# EAGLE design C64_AV-Adaptor (EAGLE 9.5.2)
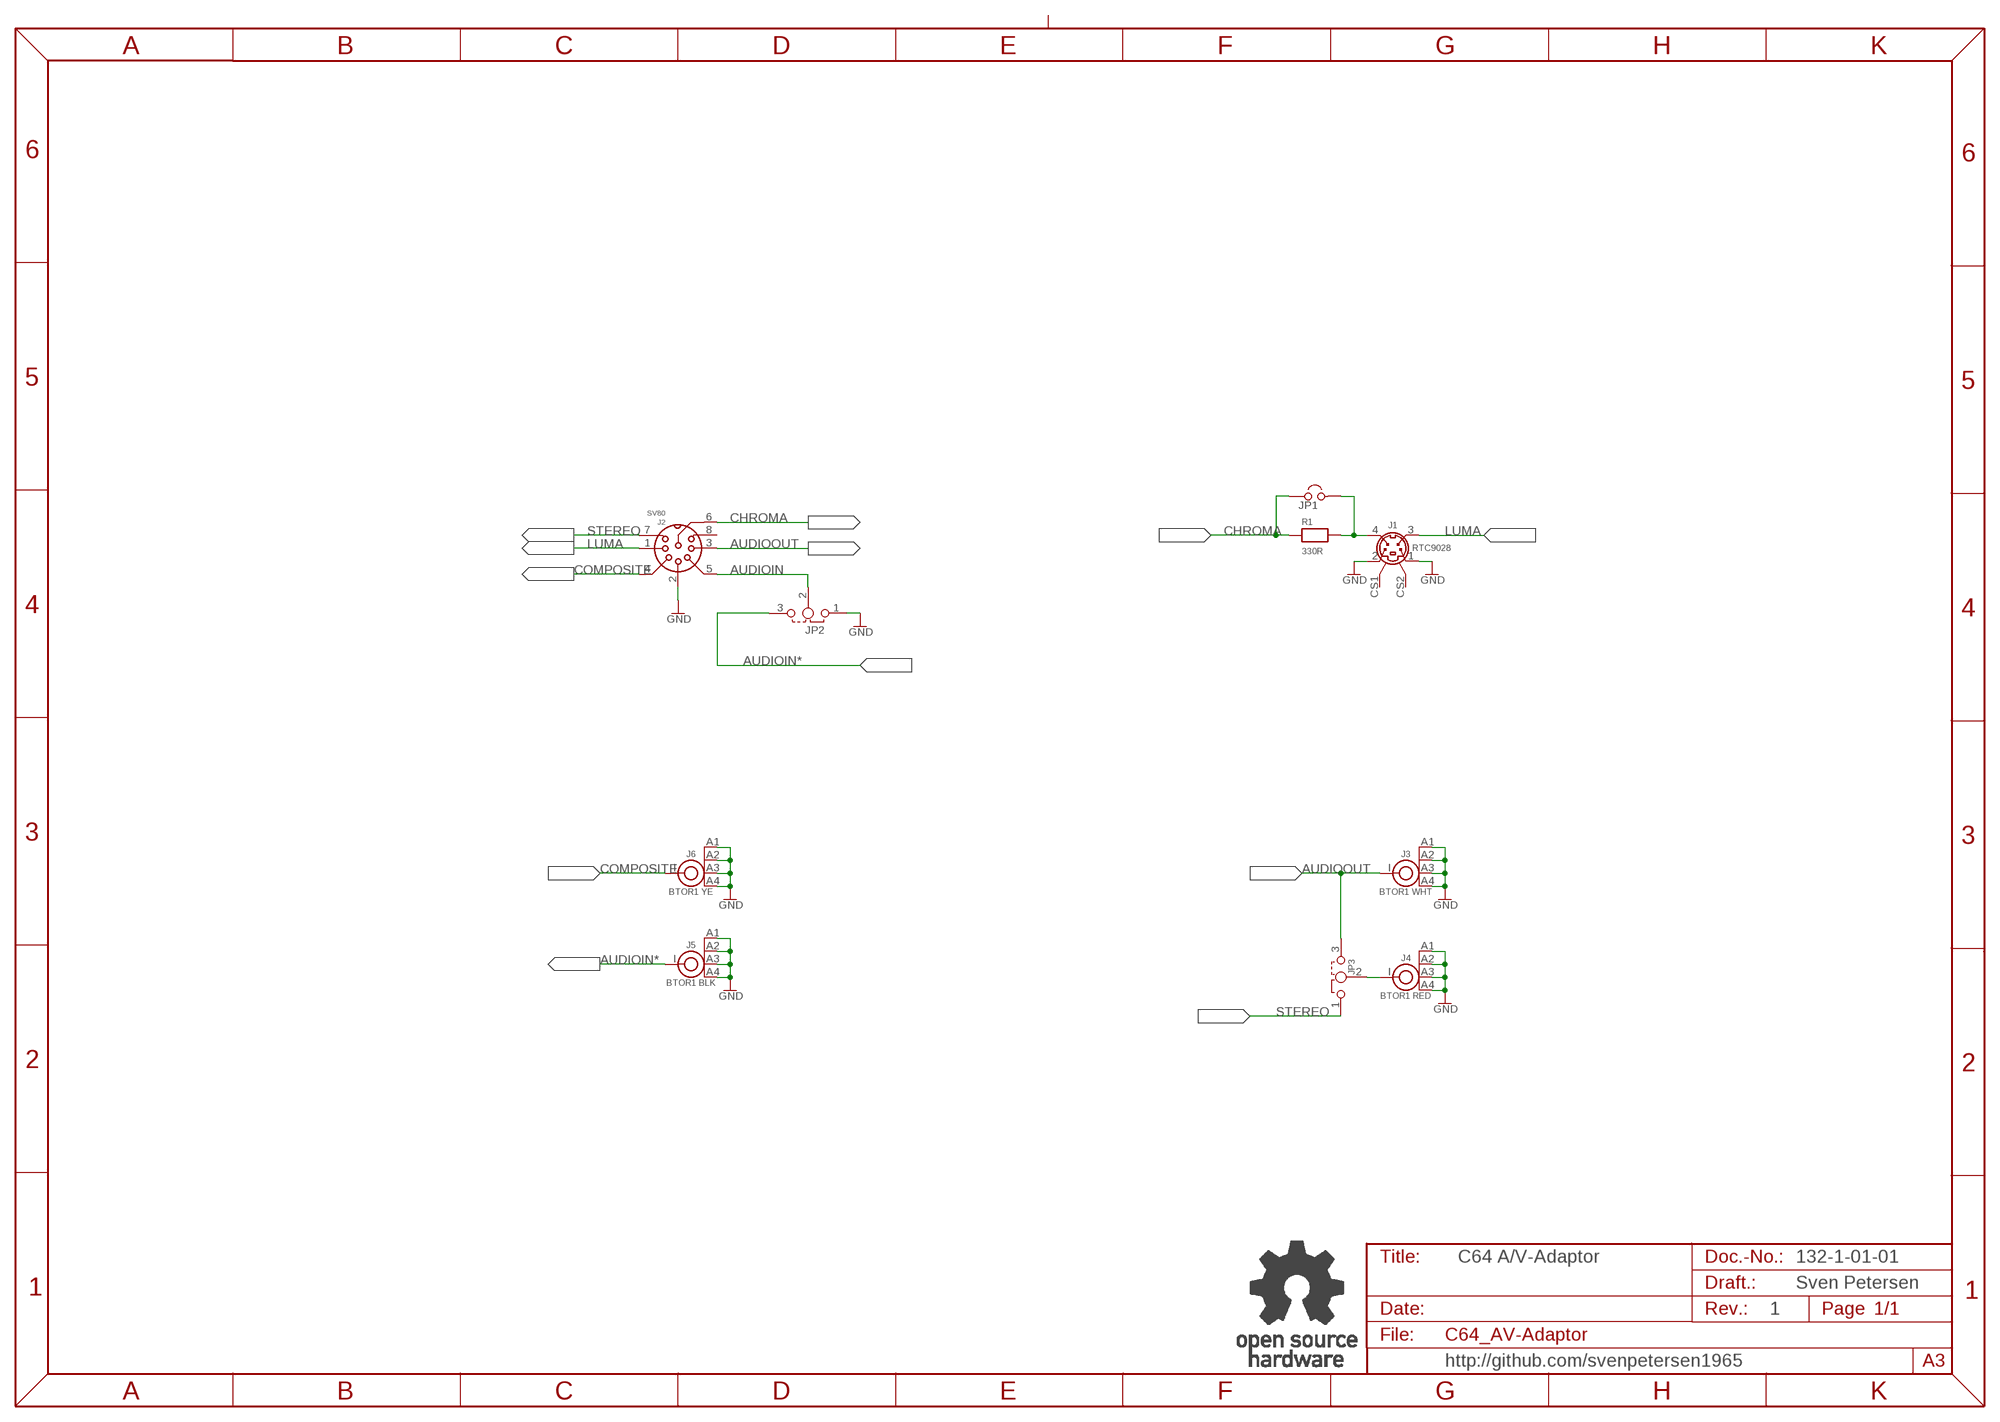
[diagram p0: schematic, sheet 1]

## Parts
J1  RTC9028  [MINIDIN4_V]
J2  SV80  [SV80_INNER]
J3  BTOR1 WHT  BTOR1  [BTOR1]
J4  BTOR1 RED  BTOR1  [BTOR1]
J5  BTOR1 BLK  BTOR1  [BTOR1]
J6  BTOR1 YE  BTOR1  [BTOR1]
JP1  JUMPER  [1X02]
JP2  DJUMPER  [1X03]
JP3  DJUMPER  [1X03]
R1  330R  RES04  [R-10]
U$25  OPEN_SOURCE_HW  [OPENHW]

## Nets
AUDIOIN: J2.5 JP2.2
AUDIOIN*: J5.I JP2.3
AUDIOOUT: J2.3 J3.I JP3.3
AUDIOR: J4.I JP3.2
CHROMA: J2.6 JP1.1 R1.1
COMPOSITE: J2.4 J6.I
GND: J1.1 J1.2 J2.2 J3.A1 J3.A2 J3.A3 J3.A4 J4.A1 J4.A2 J4.A3 J4.A4 J5.A1 J5.A2 J5.A3 J5.A4 J6.A1 J6.A2 J6.A3 J6.A4 JP2.1
LUMA: J1.3 J2.1
N$1: J1.4 JP1.2 R1.2
STEREO: J2.7 JP3.1
Unconnected: J1.CS1 J1.CS2 J2.8

## Notes on the sheet
- C64 A/V-Adaptor | 132-1-01-01
- Sven Petersen
- 1
- http://github.com/svenpetersen1965

## Library data of the parts
J1 = RTConnector:RTC9028: Mini-DIN, 4p, vertical
J2 = Lumberg:SV80: Inner part of SV80
J3-J6 = Lumberg:BTOR1
JP1 = PINHEAD:JUMPER
JP2 JP3 = PINHEAD:DJUMPER
R1 = DISCRETE:RES04
U$25 = Logo:OPEN_SOURCE_HW

## Board
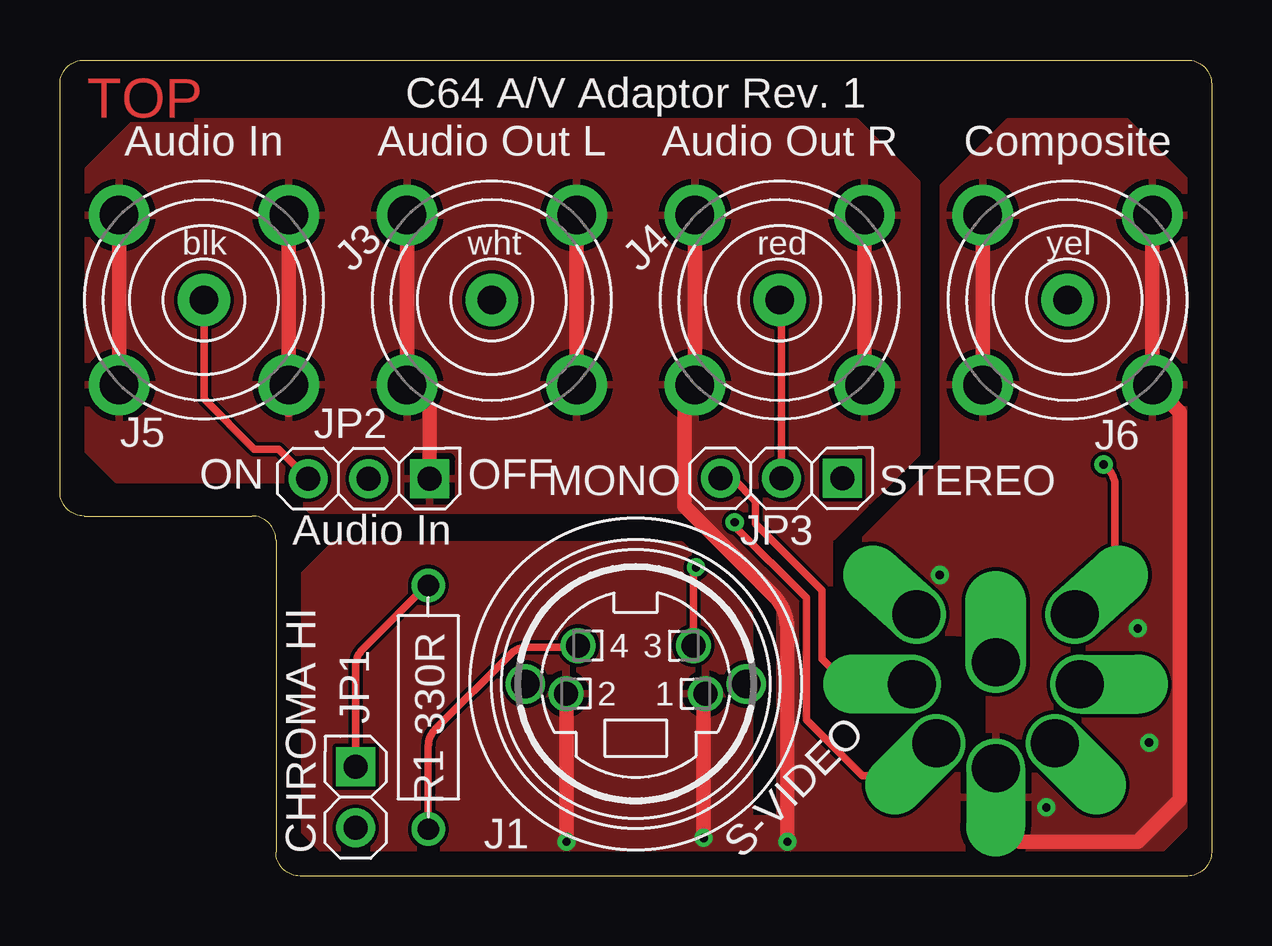
[diagram p1: board, top side]
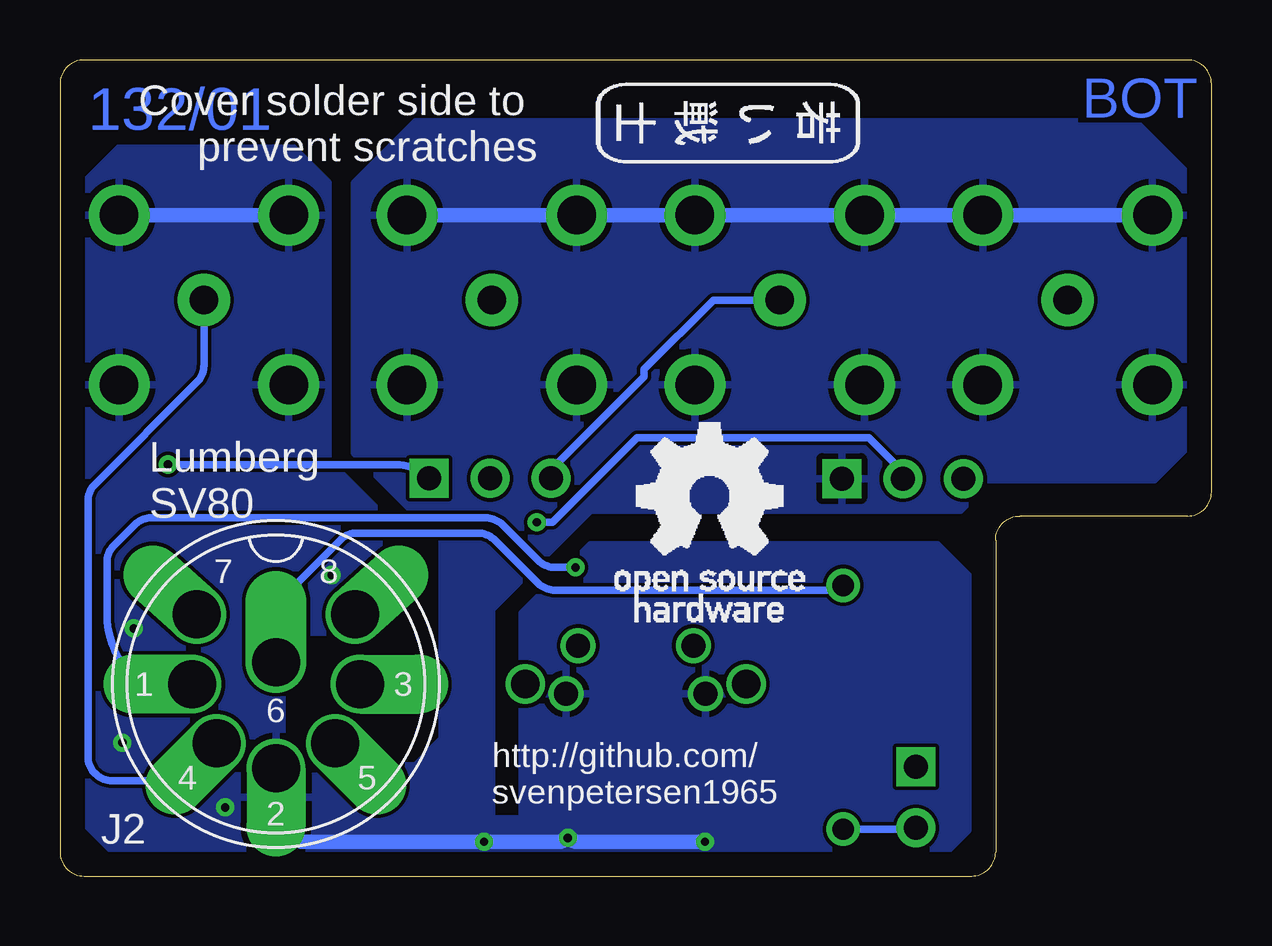
[diagram p2: board, bottom side, seen from below]

Size 48 x 34 mm. Coordinates in mm from the lower left corner, seen from the top.
Outline: 1,34 47,34 arc-90 48,33 48,1 arc-90 47,0 10,0 arc-90 9,1 9,14 arc90 8,15 1,15 arc-90 0,16 0,33 arc-90 1,34
Copper layers (1*16): Top 0.035mm / dielectric 1.5mm / Bottom 0.035mm
Design rules "default *": minimum track width 6mil, minimum drill 0.35mm, track to track 6mil, track to pad 6mil, pad to pad 6mil, via to via 6mil, smd to smd 6mil, copper to edge 40mil, drill to drill 6mil, minimum pad ring 9mil, minimum via ring 8mil, stop-mask expansion 4mil, vias tented up to drill 25mil, thermal gap 10mil
tRestrict: 2 lines
bRestrict: 3 lines

### Footprints (pad centres in the part's own frame; a part is rotated, then mirrored left to right if it is on the bottom)
MINIDIN4_V = drill 1: 1 2.9,-0.4; 2 -2.9,-0.4; 3 2.4,1.6; 4 -2.4,1.6 | drill 1.2: CS1 4.6,0; CS2 -4.6,0
SV80_INNER = drill 2 pad 2.413 offset: 1 3.5,0; 2 0,3.5; 3 -3.5,0; 4 2.47,2.47; 5 -2.47,2.47; 7 3.3,-2.9; 8 -3.3,-2.9 | drill 2 pad 2.54 offset: 6 0,-0.9
BTOR1 = drill 1.6 pad 2.54: A1 0,5; A2 5,0; A3 0,-5; A4 -5,0 | drill 1.2 pad 2.184: I 0,0
1X02 = drill 1 pad 1.626 square: 1 -1.27,0 | drill 1 pad 1.626: 2 1.27,0
1X03 = drill 1 pad 1.626 square: 1 -2.54,0 | drill 1 pad 1.626: 2 0,0; 3 2.54,0
R-10 = drill 0.889 pad 1.397: 1 -5.08,0; 2 5.08,0

### Placement (x,y rotation side)
J1  24,8 0 top
J2  39,8 180 bottom
J3  18,24 45 top
J4  30,24 45 top
J5  6,24 45 top
J6  42,24 45 top
JP1  12.32,3.27 270 top
JP2  12.87,16.56 180 top
JP3  30.07,16.57 180 top
R1  15.35,7.03 270 top
U$22  [2LAYER]  1.11,31.59 0 top
U$23  [SVEN_TAG]  20.03,31.34 270 bottom
U$24  [PCB-TITLE/]  0,40.64 0 top  (outside the outline)
U$25  24.86,10.61 0 bottom

### Tracks (layer width: path | path; a pad name or v marks a point on that pad's centre or on a via)
AUDIOIN  (via drill 0.35)
  Top 0.305: J2.5 35.19,4.18 33.44,4.18 31.11,6.51 31.11,11.59 28.12,14.58 v28.12,14.74
  Bottom 0.305: v28.12,14.74 27.46,14.74 23.95,18.26 14.29,18.26 12.87,16.84 JP2.2
AUDIOIN*
  Top 0.305: JP2.3 9.11,17.78 8.1,17.78 6,19.88 J5.I
AUDIOOUT
  Top 0.305: J2.3 35.4,8.1 32.7,8.1 31.75,9.05 31.75,11.91 28.98,14.67 28.98,15.62 28.04,16.57 JP3.3
  Bottom 0.305: JP3.3 27.53,16.92 23.65,20.8 23.65,21.11 20.77,24 J3.I
AUDIOR
  Top 0.305: JP3.2 30.07,23.83 arc45 J4.I
CHROMA
  Top 0.305: JP1.1 12.32,8.72 arc-45 12.62,9.44 15.28,12.11 R1.1
  Bottom 0.305: J2.6 39,10.91 arc45 38.71,11.62 36.33,13.99 arc45 35.62,14.29 30.58,14.29 arc45 29.86,13.99 28.08,12.2 arc-45 27.36,11.91 15.84,11.91 arc-45 R1.1
COMPOSITE
  Bottom 0.305: J2.4 43.03,3.97 45.81,3.97 arc90 46.83,4.99 46.83,15.61 arc45 46.53,16.33 42.3,20.57 arc-45 42,21.29 J6.I
GND  (via drill 0.35)
  Top 0.61: J2.2 39,2.85 arc45 39.29,2.14 40.01,1.43 44.93,1.43 46.67,3.17 46.67,3.97 46.67,19.33 J6.A3 J6.A2 | J6.A4 J6.A1 | J4.A3 J4.A2 | J4.A1 J4.A4 26.33,20.33 arc45 26.04,19.62 26.04,15.4 29.71,11.72 arc-45 30.32,10.25 v30.32,1.43 | J3.A3 J3.A2 | J3.A1 J3.A4 15.41,19.52 JP2.1 | J5.A2 J5.A3 9.54,19.43 | J5.A4 J5.A1 | v26.83,1.59 26.83,7.43 arc-45 J1.1 | v21.11,1.43 21.11,7.57 arc45 J1.2
  Bottom 0.61: J6.A1 J6.A2 | J4.A2 J4.A1 J3.A2 J3.A1 J5.A2 J5.A1 | J2.2 39,2.9 arc-45 38.71,2.19 37.94,1.43 v30.32,1.43 27.21,1.43 arc-45 v26.83,1.59 arc-45 26.45,1.43 v21.11,1.43
  other vias: 45.4,5.56 41.12,2.86 44.93,10.32 36.67,12.54
  pour Top: 10.16,12.54 11.43,13.81 25.56,13.81 25.88,13.81 28.57,11.11 28.73,10.95 28.73,2.38 29.53,2.38 30,2.38 30,11.27 26.04,15.24 10.48,15.24 9.21,16.51 2.38,16.51 0.79,18.1 0.79,29.05 3.17,31.43 32.86,31.43 33.18,31.43 35.08,29.53 35.72,28.89 35.72,17.62 32.23,14.13 32.07,14.13 32.07,5.71 33.18,4.6 33.97,4.6 34.61,5.24 34.61,5.71 33.02,7.3 33.02,13.49 33.18,13.65 36.83,17.3 36.83,28.73 39.53,31.43 42.7,31.43 44.45,31.43 46.99,28.89 46.99,2.22 45.72,0.95 11.11,0.95 10.16,1.91
  pour Bottom: 11.11,0.95 10.16,1.91 10.16,12.54 11.43,13.81 25.88,13.81 28.73,10.95 28.73,2.38 30,2.38 30,11.11 25.88,15.24 10.48,15.24 9.21,16.51 2.38,16.51 0.79,18.1 0.79,29.05 3.17,31.43 33.18,31.43 35.72,28.89 35.72,17.62 32.07,13.97 32.07,5.71 33.18,4.6 33.97,4.6 34.61,5.24 34.61,5.71 33.02,7.3 33.02,13.49 36.83,17.3 36.83,28.89 39.37,31.43 44.45,31.43 46.99,28.89 46.99,2.22 45.72,0.95
LUMA  (via drill 0.35)
  Top 0.305: v26.51,12.86 arc45 26.4,12.59 J1.3
  Bottom 0.305: J2.1 42.82,8.32 44.97,8.32 arc45 46.04,10.89 46.04,13.07 arc45 45.74,13.79 44.91,14.62 arc45 44.19,14.92 30.26,14.92 arc45 29.55,14.63 28.08,13.16 arc-45 27.36,12.86 v26.51,12.86
N$1
  Top 0.305: R1.2 15.35,5.41 arc-45 15.65,6.13 18.75,9.23 arc-45 19.47,9.53 21.52,9.53 J1.4
  Bottom 0.305: R1.2 12.38,1.95 JP1.2
STEREO  (via drill 0.35)
  Top 0.305: J2.7 43.68,12.28 arc45 43.97,12.99 43.97,16.25 arc45 43.68,16.96 v43.5,17.14
  Bottom 0.305: v43.5,17.14 34.01,17.14 arc45 JP3.1

### Text on the board
Bottom: 132/01
tPlace: C64 A/V Adaptor Rev. 1 | Audio In | Audio Out L | Audio Out R | Composite | blk | wht | red | yel | ON | OFF | MONO | STEREO | Audio In | 330R | CHROMA HI | S-VIDEO
bPlace: Cover solder side to / prevent scratches | Lumberg / SV80 | http://github.com/ / svenpetersen1965
Document: Sven Petersen | 132-2-01-01 | 2020 | 35µm | 2 | 1